# Altium project LCR.PrjPcb
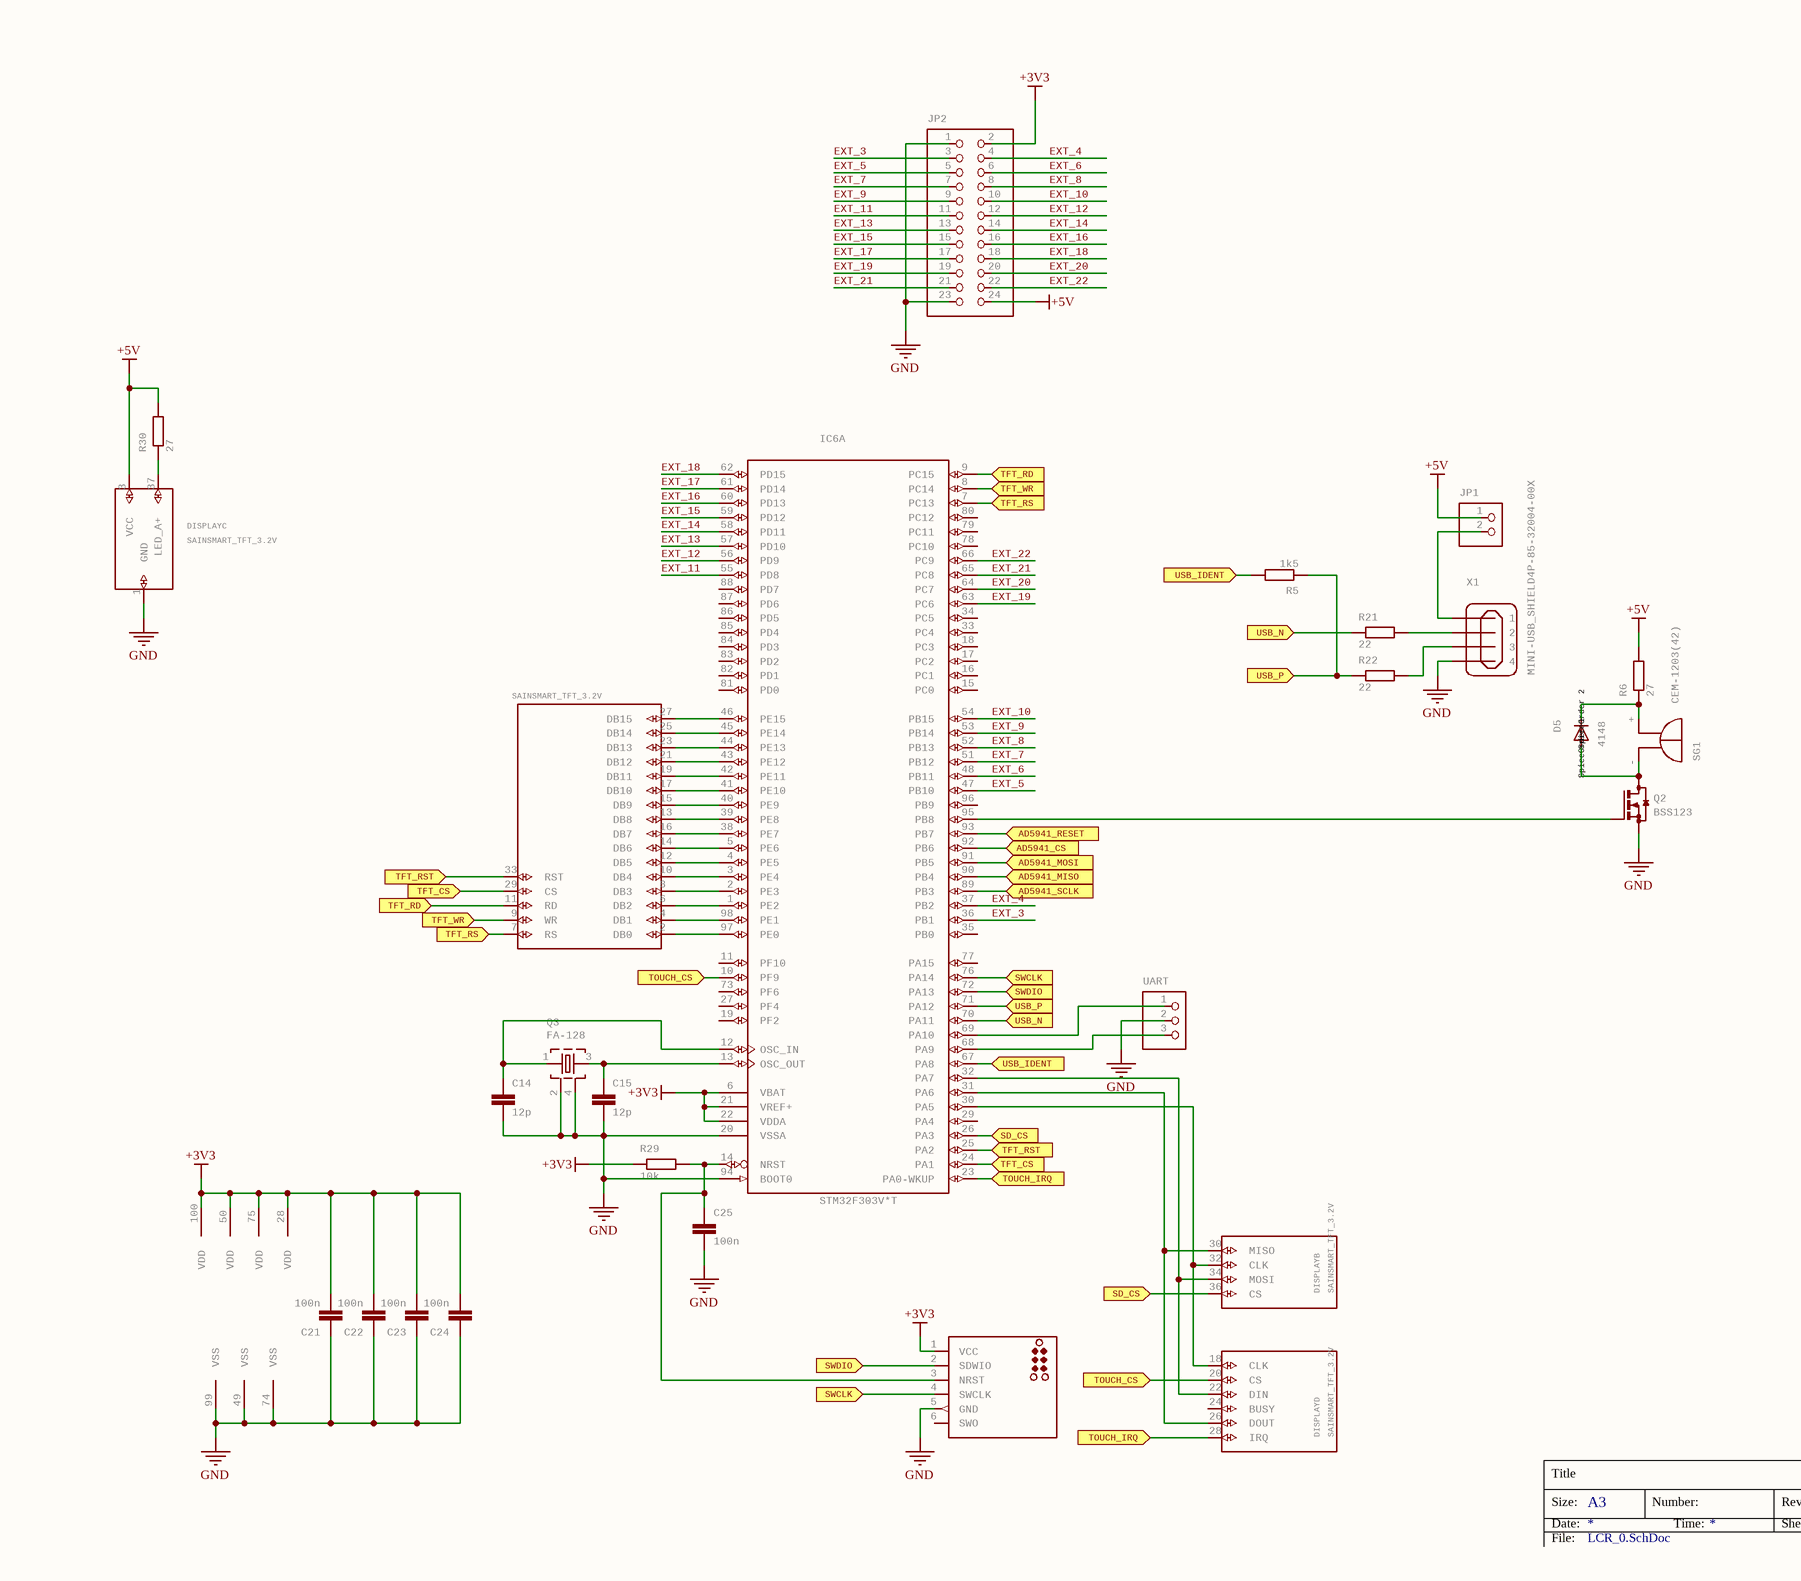
[diagram p0: LCR_0.SchDoc]
3 sheets, 95 parts. Net scope: flat (ports and power ports of the same name join across sheets).
Board file: LCR.PcbDoc
Sheets:
  LCR_0.SchDoc
  LCR_1.SchDoc
  LCR_2.SchDoc

## Sheet LCR_0.SchDoc
size 316 x 277 mm; Organization: Altium Limited; Address1: L3, 12a Rodborough Rd; Address2: Frenchs Forest; Address3: NSW; Address4: Australia 2086; Origin: Eagle

### Parts
C14  value 12p  [C0603K]
C15  value 12p  [C0603K]
C21  value 100n  [C0603K]
C22  value 100n  [C0603K]
C23  value 100n  [C0603K]
C24  value 100n  [C0603K]
C25  value 100n  [C0603K]
D5  value 4148  SpiceOrder1: SpiceOrder 1  SpiceOrder2: SpiceOrder 2  [SOD123]
DISPLAY  SAINSMART_TFT_3.2V  [SAINSMART_ANGLED]  (parts A,B,C,D of 4)
IC6  STM32F303V*T  [LQFP100]  (parts A,B of 2)
J1  TC2030-MCP  [TC2030-MCP]  (value not drawn)
JP1  (no value)  [1X02]
JP2  (no value)  [2X12]
Q2  BSS123  [SOT23]
Q3  FA-128  [FA-128]
R5  value 1k5  [R0603]
R6  value 27  [R1206]
R21  value 22  [R0603]
R22  value 22  [R0603]
R29  value 10k  [R0603]
R30  value 27  [R1206]
SG1  CEM-1203(42)  [F/QMBIII]
UART  (no value)  [1X03]
X1  MINI-USB_SHIELD4P-85-32004-00X  [85-32004-00X]

### Ports
AD5941_CS (in), AD5941_MISO (in), AD5941_MOSI (in), AD5941_RESET (in), AD5941_SCLK (in), SD_CS (in), SWCLK (in), SWDIO (in), TFT_CS (in), TFT_RD (in), TFT_RS (in), TFT_RST (in), TFT_WR (in), TOUCH_CS (in), TOUCH_IRQ (in), USB_IDENT (in), USB_N (in), USB_P (in)

### Nets
+3V3: C21.2 C22.2 C23.2 C24.2 IC6.6(VBAT) IC6.21(VREF+) IC6.22(VDDA) IC6.28(VDD) IC6.50(VDD) IC6.75(VDD) IC6.100(VDD) J1.1(VCC) JP2.2 R29.1
+5V: DISPLAY.3(VCC) JP1.1 JP2.24 R6.2 R30.2
GND: C14.2 C15.2 C21.1 C22.1 C23.1 C24.1 C25.2 DISPLAY.1(GND) IC6.20(VSSA) IC6.49(VSS) IC6.74(VSS) IC6.94(BOOT0) IC6.99(VSS) J1.5(GND) JP2.1 JP2.23 Q2.2(S) Q3.2 Q3.4 UART.2 X1.4
EXT_3: IC6.36(PB1) JP2.3
EXT_4: IC6.37(PB2) JP2.4
EXT_5: IC6.47(PB10) JP2.5
EXT_6: IC6.48(PB11) JP2.6
EXT_7: IC6.51(PB12) JP2.7
EXT_8: IC6.52(PB13) JP2.8
EXT_9: IC6.53(PB14) JP2.9
EXT_10: IC6.54(PB15) JP2.10
EXT_11: IC6.55(PD8) JP2.11
EXT_12: IC6.56(PD9) JP2.12
EXT_13: IC6.57(PD10) JP2.13
EXT_14: IC6.58(PD11) JP2.14
EXT_15: IC6.59(PD12) JP2.15
EXT_16: IC6.60(PD13) JP2.16
EXT_17: IC6.61(PD14) JP2.17
EXT_18: IC6.62(PD15) JP2.18
EXT_19: IC6.63(PC6) JP2.19
EXT_20: IC6.64(PC7) JP2.20
EXT_21: IC6.65(PC8) JP2.21
EXT_22: IC6.66(PC9) JP2.22
NetC14_1: C14.1 IC6.12(OSC_IN) Q3.1
NetC15_1: C15.1 IC6.13(OSC_OUT) Q3.3
NetC25_1: C25.1 IC6.14(NRST) J1.3(NRST) R29.2
NetD5_A: D5.A Q2.3(D) SG1.-(+)
NetD5_C: D5.C R6.1 SG1.+(-)
NetDISPLAY_2: DISPLAY.2(DB0) IC6.97(PE0)
NetDISPLAY_4: DISPLAY.4(DB1) IC6.98(PE1)
NetDISPLAY_6: DISPLAY.6(DB2) IC6.1(PE2)
NetDISPLAY_7: DISPLAY.7(RS) IC6.7(PC13) ; port TFT_RS
NetDISPLAY_8: DISPLAY.8(DB3) IC6.2(PE3)
NetDISPLAY_9: DISPLAY.9(WR) IC6.8(PC14) ; port TFT_WR
NetDISPLAY_10: DISPLAY.10(DB4) IC6.3(PE4)
NetDISPLAY_11: DISPLAY.11(RD) IC6.9(PC15) ; port TFT_RD
NetDISPLAY_12: DISPLAY.12(DB5) IC6.4(PE5)
NetDISPLAY_13: DISPLAY.13(DB8) IC6.39(PE8)
NetDISPLAY_14: DISPLAY.14(DB6) IC6.5(PE6)
NetDISPLAY_15: DISPLAY.15(DB9) IC6.40(PE9)
NetDISPLAY_16: DISPLAY.16(DB7) IC6.38(PE7)
NetDISPLAY_17: DISPLAY.17(DB10) IC6.41(PE10)
NetDISPLAY_18: DISPLAY.18(CLK) DISPLAY.32(CLK) IC6.30(PA5)
NetDISPLAY_19: DISPLAY.19(DB11) IC6.42(PE11)
NetDISPLAY_20: DISPLAY.20(CS) IC6.10(PF9) ; port TOUCH_CS
NetDISPLAY_21: DISPLAY.21(DB12) IC6.43(PE12)
NetDISPLAY_22: DISPLAY.22(DIN) DISPLAY.34(MOSI) IC6.32(PA7)
NetDISPLAY_23: DISPLAY.23(DB13) IC6.44(PE13)
NetDISPLAY_25: DISPLAY.25(DB14) IC6.45(PE14)
NetDISPLAY_26: DISPLAY.26(DOUT) DISPLAY.30(MISO) IC6.31(PA6)
NetDISPLAY_27: DISPLAY.27(DB15) IC6.46(PE15)
NetDISPLAY_28: DISPLAY.28(IRQ) IC6.23(PA0-WKUP) ; port TOUCH_IRQ
NetDISPLAY_29: DISPLAY.29(CS) IC6.24(PA1) ; port TFT_CS
NetDISPLAY_33: DISPLAY.33(RST) IC6.25(PA2) ; port TFT_RST
NetDISPLAY_36: DISPLAY.36(CS) IC6.26(PA3) ; port SD_CS
NetDISPLAY_37: DISPLAY.37(LED_A+) R30.1
NetIC3_2: IC6.93(PB7) ; port AD5941_RESET
NetIC3_3: IC6.92(PB6) ; port AD5941_CS
NetIC3_4: IC6.89(PB3) ; port AD5941_SCLK
NetIC3_5: IC6.91(PB5) ; port AD5941_MOSI
NetIC3_6: IC6.90(PB4) ; port AD5941_MISO
NetIC6_67: IC6.67(PA8) R5.2 ; port USB_IDENT
NetIC6_68: IC6.68(PA9) UART.3
NetIC6_69: IC6.69(PA10) UART.1
NetIC6_70: IC6.70(PA11) R21.1 ; port USB_N
NetIC6_71: IC6.71(PA12) R5.1 R22.1 ; port USB_P
NetIC6_72: IC6.72(PA13) J1.2(SDWIO) ; port SWDIO
NetIC6_76: IC6.76(PA14) J1.4(SWCLK) ; port SWCLK
NetIC6_95: IC6.95(PB8) Q2.1(G)
NetJP1_2: JP1.2 X1.1
NetR21_2: R21.2 X1.2
NetR22_2: R22.2 X1.3

Not connected (* = marked no-connect by the designer): DISPLAY 24(BUSY); IC6 11(PF10) 15(PC0) 16(PC1) 17(PC2) 18(PC3) 19(PF2) 27(PF4) 29(PA4) 33(PC4) 34(PC5) 35(PB0) 73(PF6) 77(PA15) 78(PC10) 79(PC11) 80(PC12) 81(PD0) 82(PD1) 83(PD2) 84(PD3) 85(PD4) 86(PD5) 87(PD6) 88(PD7) 96(PB9); J1 6(SWO)

### Notes on the sheet
- Title
- Size:
- Date:
- A3
- Number:
- Time:
- Revision:
- Sheet
- of
- RayaBonyanLotus
- File:

### Library data of the parts
C14 C15 C21-C25 = C-EUC0603K: CAPACITOR, European symbol; GateName_1: G$1; SymbolName_1: C-EU; DeviceName: C0603K; LibraryName: rcl; DeviceSetName: C-EU
D5 = DIODE-SOD123: DIODE; GateName_1: G$1; SymbolName_1: D; DeviceSetName: DIODE-; DeviceName: SOD123; LibraryName: diode
DISPLAY = SAINSMART_TFT_3.2V: GateName_1: SSD1289; SymbolName_1: LCDCONTROLLER; GateName_2: SD-CARD; SymbolName_2: LCDSD; GateName_3: SUPPLY; SymbolName_3: LCDSUPPLY; GateName_4: ADS7843; SymbolName_4: LCDTOUCH; DeviceName: V; LibraryName: sainsmart; DeviceSetName: SAINSMART_TFT_3.2
IC6 = STM32F303V*T: ARM 32-bit Cortexâ„¢-M3 CPU   72 MHz maximum frequency 128 to 256 Kbytes of Flash memory 32 to 40 kbytes of SRAM 87 GPIOs 2.0 to 3.6 V application supply; GateName_1: MCU; SymbolName_1: STM32_100PIN_TYP3; GateName_2: PWR; SymbolName_2: PWR_VDD4_VSS3; LibraryName: micro-stm_v3; DeviceSetName: STM32F303V*T
J1 = TC2030-MCP: TAG-CONNECT ICSP Connector  Manufacturer: Tag-Connect  Cable for easy In-Circuit Serial Programming. Designed for Microchip ICD2, suitable for many others. Two variants - one "with legs" (for hands-free fit on PCB) and another "without legs" for quick programming.       	   PAD	Description	   1	MCLR/Vpp	   2	Vdd	   3	GND	   4	PGD (ISPDAT)	   5	PGC (ISPCLK)	   6	nc (used for LVP)		  آ©2009 ROFA.cz - modified and updated by Robert Darlington ‹rdarlington@gmail.com›; GateName_1: G$1; DeviceName: -MCP; DeviceSetName: TC2030; SymbolName_1: ICSP; LibraryName: tag-connect
JP1 = PINHD-1X2: PIN HEADER; GateName_1: G$1; SymbolName_1: PINHD2; LibraryName: pinhead; DeviceSetName: PINHD-1X2; VALUE: PINHD-1X2
JP2 = PINHD-2X12: PIN HEADER; GateName_1: A; SymbolName_1: PINH2X12; LibraryName: pinhead; DeviceSetName: PINHD-2X12; VALUE: PINHD-2X12
Q2 = BSS123: N-CHANNEL MOS FET; GateName_1: G$1; SymbolName_1: N-MOS; LibraryName: transistor-small-signal; DeviceSetName: BSS123
Q3 = FA-128: MHz RANGE CRYSTAL UNIT    Source: Epson Toyocom; GateName_1: G$1; SymbolName_1: Q-SHIELD2; DeviceName: 128; DeviceSetName: FA-; LibraryName: crystal
R5 R21 R22 R29 = R-EU_R0603: RESISTOR, European symbol; GateName_1: G$1; SymbolName_1: R-EU-1; DeviceSetName: R-EU_; DeviceName: R0603; LibraryName: resistor
R6 R30 = R-EU_R1206: RESISTOR, European symbol; GateName_1: G$1; SymbolName_1: R-EU-1; DeviceSetName: R-EU_; DeviceName: R1206; LibraryName: resistor
SG1 = F/QMBIII: BUZZER    Source: Buerklin; GateName_1: G$1; SymbolName_1: B; LibraryName: buzzer; DeviceSetName: F/QMBIII; MF: MF; MPN: MPN; OC_FARNELL: unknown; OC_NEWARK: unknown
UART = PINHD-1X3: PIN HEADER; GateName_1: A; SymbolName_1: PINHD3; LibraryName: pinhead; DeviceSetName: PINHD-1X3; VALUE: PINHD-1X3
X1 = MINI-USB_SHIELD4P-85-32004-00X: MINI USB 4 Pol.   Source: www.cypressindustries.com; GateName_1: G$1; SymbolName_1: MINI-USB-4P-; DeviceName: 85-32004-00X; LibraryName: con-cypressindustries; DeviceSetName: MINI-USB_SHIELD4P-; MF: MF; MPN: MPN; OC_FARNELL: unknown; OC_NEWARK: unknown

## Sheet LCR_1.SchDoc
size 282 x 203 mm; DRAWING_NAME: LCR; LAST_DATE_TIME: 22/09/30 10:23:00 PM; SHEET: 2; LAST_DATE_TIME: 22/09/30 10:23:00 PM; Organization: Altium Limited; Address1: L3, 12a Rodborough Rd; Address2: Frenchs Forest; Address3: NSW; Address4: Australia 2086; DRAWING_NAME: LCR; SHEET: 2; Origin: Eagle
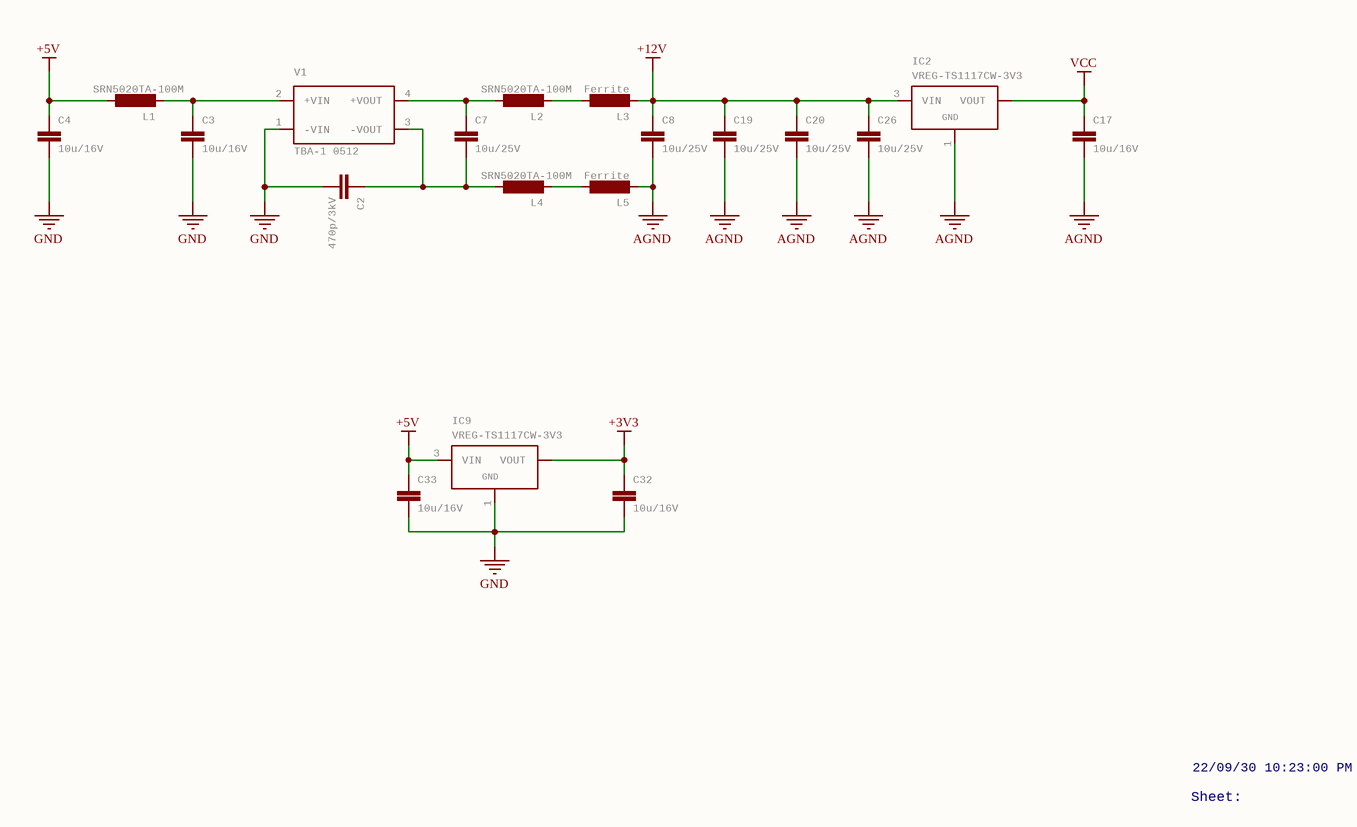
[diagram p1: LCR_1.SchDoc]

### Parts
C2  value 470p/3kV  [C1812]
C3  value 10u/16V  [C1206K]
C4  value 10u/16V  [C1206K]
C7  value 10u/25V  [C1206K]
C8  value 10u/25V  [C1206K]
C17  value 10u/16V  [C1206K]
C19  value 10u/25V  [C1206K]
C20  value 10u/25V  [C1206K]
C26  value 10u/25V  [C1206K]
C32  value 10u/16V  [C1206K]
C33  value 10u/16V  [C1206K]
IC2  VREG-TS1117CW-3V3  [SOT223]
IC9  VREG-TS1117CW-3V3  [SOT223]
L1  SRN5020TA-100M  [SRN5040]
L2  SRN5020TA-100M  [SRN5040]
L3  Ferrite  [R0603]
L4  SRN5020TA-100M  [SRN5040]
L5  Ferrite  [R0603]
V1  TBA-1 0512  [TME]

### Nets
+3V3: C32.1 IC9.2_4(VOUT)
+5V: C4.1 C33.1 IC9.3(VIN) L1.P$1
+12V: C8.1 C19.1 C20.1 C26.1 IC2.3(VIN) L3.2
AGND: C8.2 C17.2 C19.2 C20.2 C26.2 IC2.1(GND) L5.2
GND: C2.2 C3.2 C4.2 C32.2 C33.2 IC9.1(GND) V1.1(-VIN)
VCC: C17.1 IC2.2_4(VOUT)
NetC2_1: C2.1 C7.2 L4.P$1 V1.3(-VOUT)
NetC3_1: C3.1 L1.P$2 V1.2(+VIN)
NetC7_1: C7.1 L2.P$1 V1.4(+VOUT)
NetL2_P$2: L2.P$2 L3.1
NetL4_P$2: L4.P$2 L5.1

### Notes on the sheet
- Sheet:
- 22/09/30 10:23:00 PM
- Title
- Size:
- Date:
- A3
- Number:
- Time:
- Revision:
- Sheet
- of
- RayaBonyanLotus
- File:

### Library data of the parts
C2 = C-EUC1812: CAPACITOR, European symbol; GateName_1: G$1; SymbolName_1: C-EU-1; DeviceSetName: C-EU; DeviceName: C1812; LibraryName: resistor
C3 C4 C7 C8 C17 C19 C20 C26 C32 C33 = C-EUC1206K: CAPACITOR, European symbol; GateName_1: G$1; SymbolName_1: C-EU; DeviceName: C1206K; LibraryName: rcl; DeviceSetName: C-EU
IC2 IC9 = VREG-TS1117CW-3V3: Voltage Regulators (LDOs, Switching Converters...)  LDOs Taiwan Semi TS1117 800mA max 15V  - compatible On Semi NCP1117 1A max 20V  - compatible Diodes AP2111H 0.6A max 6V (0.25V@0.6A)  - compatible Diodes AP2114H 1A max 6V (0.45V@1A) Taiwan Semi TS9011 250mA max 12V  - compatible Diodes AP2210 300mA max 15V  - compatible Microchip MCP1700 250mA max 6.5V  - compatible Microchip MCP1702 250mA max 13V  - compatible Microchip MCP1703 250mA max 16V  - compatible Microchip MCP1754 150mA max 16V Taiwan Semi TS5204 150mA max 16V (low noise)  DC/DC Converter Modules Recom R-78Ex.x-1.0-W36 1A max 28V  - compatible CUI V78xx-2000  2A max 18V Murata OKI-78SR-x.x/1.5-W36 1.5A max 36V; GateName_1: IC; SymbolName_1: VREG; DeviceName: -TS1117CW-3V3; LibraryName: we-power-mod; DeviceSetName: VREG; GND: GND
L1 L2 L4 = SRN5040: GateName_1: G$1; SymbolName_1: L-EU; LibraryName: custom-ic; DeviceSetName: SRN5040
L3 L5 = INDUCTOR0603: GateName_1: G$1; SymbolName_1: L-EU; DeviceName: 0603; LibraryName: rf; DeviceSetName: INDUCTOR
V1 = TME?*05: DC/DC Converter TME Series 1 Watt    Source: www.tracopower.com .. tme.pdf; MPN: TME 0505S; GateName_1: G$1; SymbolName_1: DC-DC-CONVERTER; DeviceName: 05; DeviceSetName: TME?*; LibraryName: traco-electronic; MF: MF; OC_FARNELL: 1007538; OC_NEWARK: 51R5321

## Sheet LCR_2.SchDoc
size 282 x 208 mm; DRAWING_NAME: LCR; LAST_DATE_TIME: 22/09/30 10:23:00 PM; SHEET: 3; LAST_DATE_TIME: 22/09/30 10:23:00 PM; Organization: Altium Limited; Address1: L3, 12a Rodborough Rd; Address2: Frenchs Forest; Address3: NSW; Address4: Australia 2086; DRAWING_NAME: LCR; SHEET: 3; Origin: Eagle
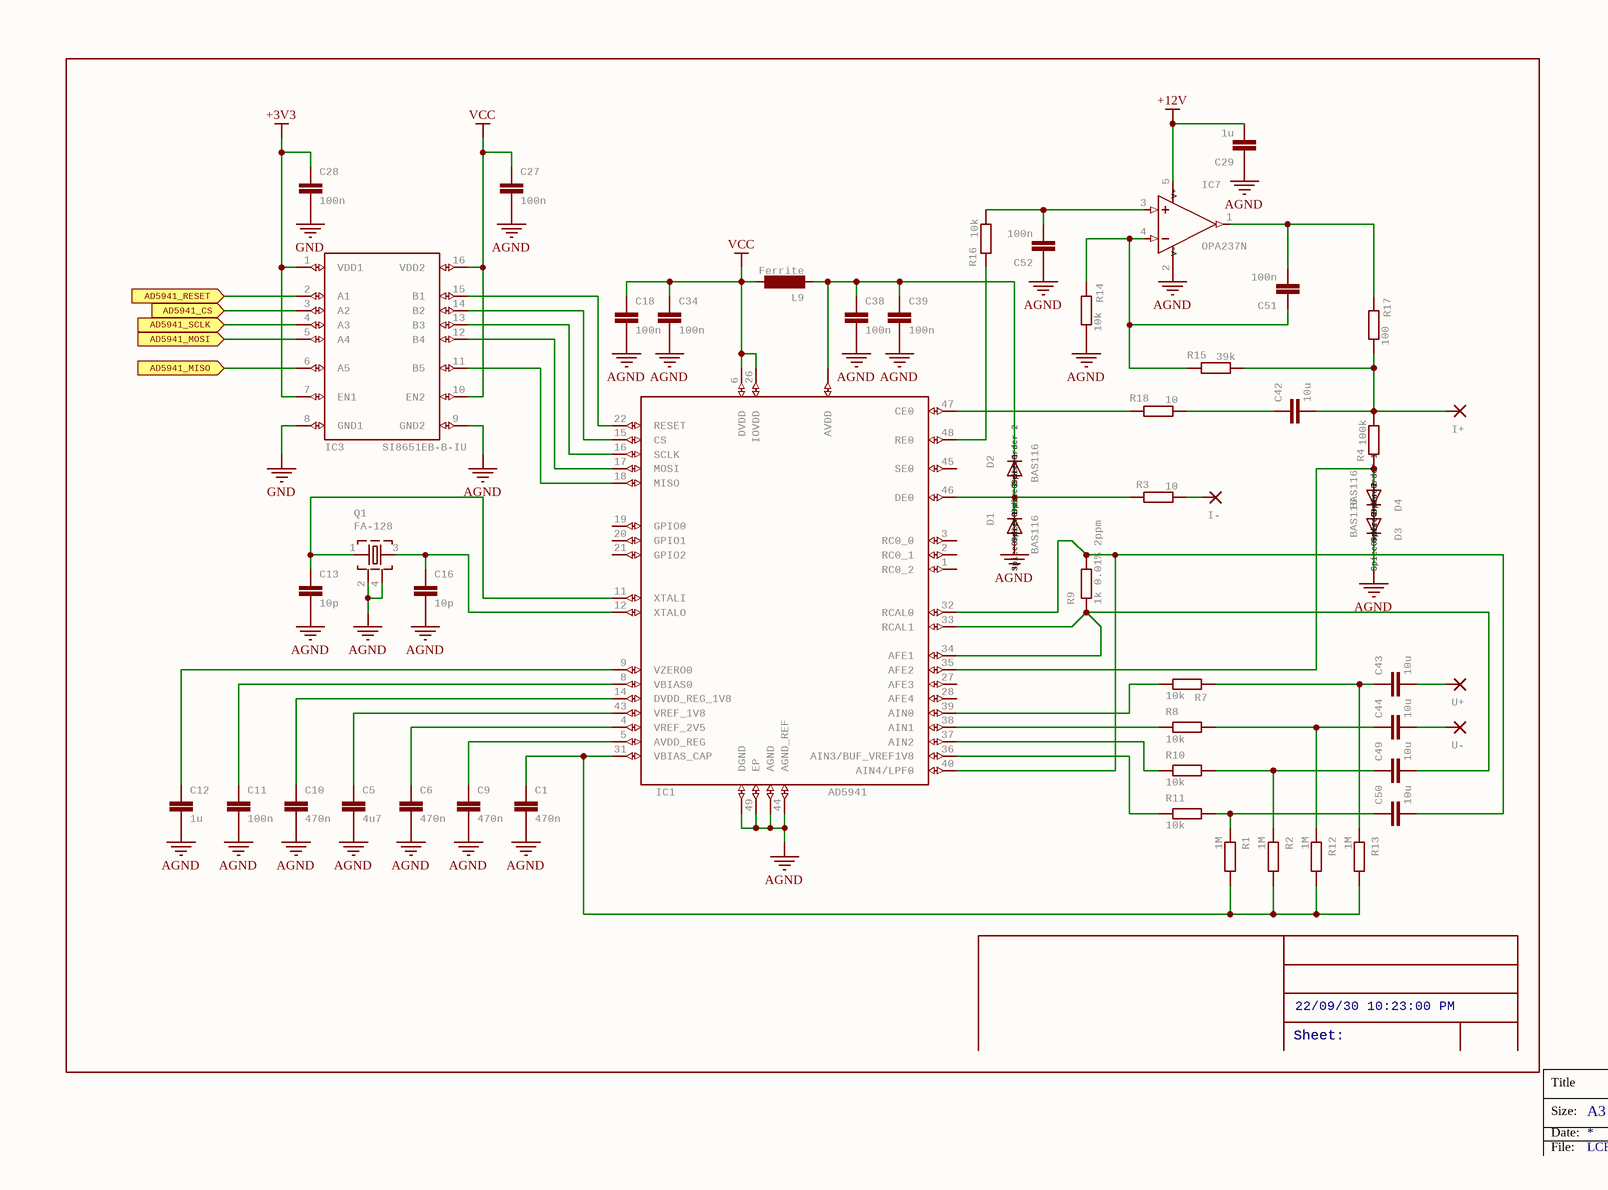
[diagram p2: LCR_2.SchDoc]

### Parts
C1  value 470n  [C0603K]
C5  value 4u7  [C0603K]
C6  value 470n  [C0603K]
C9  value 470n  [C0603K]
C10  value 470n  [C0603K]
C11  value 100n  [C0603K]
C12  value 1u  [C0603K]
C13  value 10p  [C0603K]
C16  value 10p  [C0603K]
C18  value 100n  [C0603K]
C27  value 100n  [C0603K]
C28  value 100n  [C0603K]
C29  value 1u  [C0603K]
C34  value 100n  [C0603K]
C38  value 100n  [C0603K]
C39  value 100n  [C0603K]
C42  value 10u  [C1206K]
C43  value 10u  [C1206K]
C44  value 10u  [C1206K]
C49  value 10u  [C1206K]
C50  value 10u  [C1206K]
C51  value 100n  [C0603K]
C52  value 100n  [C0603K]
D1  value BAS116  SpiceOrder1: SpiceOrder 1  SpiceOrder2: SpiceOrder 2  [SOD123]
D2  value BAS116  SpiceOrder1: SpiceOrder 1  SpiceOrder2: SpiceOrder 2  [SOD123]
D3  value BAS116  SpiceOrder1: SpiceOrder 1  SpiceOrder2: SpiceOrder 2  [SOD123]
D4  value BAS116  SpiceOrder1: SpiceOrder 1  SpiceOrder2: SpiceOrder 2  [SOD123]
I+  (no value)  [2,54/1,1]
I-  (no value)  [2,54/1,1]
IC1  AD5941  [QFN50P700X700X80-49T510N]
IC3  SI8651EB-B-IU  [SOP63P600X175-16N]
IC7  OPA237N  [SOT23-5]
L9  Ferrite  [R0603]
Q1  FA-128  [FA-128]
R1  value 1M  [R0603]
R2  value 1M  [R0603]
R3  value 10  [R0603]
R4  value 100k  [R0603]
R7  value 10k  [R0603]
R8  value 10k  [R0603]
R9  value 1k 0.01% 2ppm  [M0805]
R10  value 10k  [R0603]
R11  value 10k  [R0603]
R12  value 1M  [R0603]
R13  value 1M  [R0603]
R14  value 10k  [R0603]
R15  value 39k  [R0603]
R16  value 10k  [R0603]
R17  value 100  [R0603]
R18  value 10  [R0603]
U+  (no value)  [2,54/1,1]
U-  (no value)  [2,54/1,1]

### Ports
AD5941_CS (in), AD5941_MISO (in), AD5941_MOSI (in), AD5941_RESET (in), AD5941_SCLK (in)

### Nets
+3V3: C28.1 IC3.1(VDD1) IC3.7(EN1)
+12V: C29.2 IC7.5(V+)
AGND: C1.2 C5.2 C6.2 C9.2 C10.2 C11.2 C12.2 C13.2 C16.2 C18.2 C27.2 C29.1 C34.2 C38.2 C39.2 C52.1 D1.A D3.C IC1.13_23_25(DGND) IC1.29_42(AGND) IC1.44(AGND_REF) IC1.49(EP) IC3.9(GND2) IC7.2(V-) Q1.2 Q1.4 R14.1
GND: C28.2 IC3.8(GND1)
VCC: C18.1 C27.1 C34.1 IC1.6(DVDD) IC1.26(IOVDD) IC3.10(EN2) IC3.16(VDD2) L9.1
NetC1_1: C1.1 IC1.31(VBIAS_CAP) R1.2 R2.2 R12.2 R13.2
NetC5_1: C5.1 IC1.43(VREF_1V8)
NetC6_1: C6.1 IC1.4(VREF_2V5)
NetC9_1: C9.1 IC1.5(AVDD_REG)
NetC10_1: C10.1 IC1.14(DVDD_REG_1V8)
NetC11_1: C11.1 IC1.8(VBIAS0)
NetC12_1: C12.1 IC1.9(VZERO0)
NetC13_1: C13.1 IC1.11(XTALI) Q1.1
NetC16_1: C16.1 IC1.12(XTALO) Q1.3
NetC38_1: C38.1 C39.1 D2.C IC1.30_41(AVDD) L9.2
NetC42_1: C42.1 R18.1
NetC42_2: C42.2 I+.1(P) R4.1 R15.1 R17.1
NetC43_1: C43.1 R7.2 R13.1
NetC43_2: C43.2 U+.1(P)
NetC44_1: C44.1 R8.2 R12.1
NetC44_2: C44.2 U-.1(P)
NetC49_1: C49.1 R2.1 R10.2
NetC49_2: C49.2 IC1.33(RCAL1) IC1.34(AFE1) R9.1
NetC50_1: C50.1 R1.1 R11.2
NetC50_2: C50.2 D4.A IC1.32(RCAL0) IC1.35(AFE2) IC1.40(AIN4/LPF0) R4.2 R9.2
NetC51_1: C51.1 IC7.4(-IN) R14.2 R15.2
NetC51_2: C51.2 IC7.1(OUT) R17.2
NetC52_2: C52.2 IC7.3(+IN) R16.1
NetD1_C: D1.C D2.A IC1.46(DE0) R3.2
NetD3_A: D3.A D4.C
NetI-_1: I-.1(P) R3.1
NetIC1_15: IC1.15(CS) IC3.14(B2)
NetIC1_16: IC1.16(SCLK) IC3.13(B3)
NetIC1_17: IC1.17(MOSI) IC3.12(B4)
NetIC1_18: IC1.18(MISO) IC3.11(B5)
NetIC1_22: IC1.22(RESET) IC3.15(B1)
NetIC1_36: IC1.36(AIN3/BUF_VREF1V8) R11.1
NetIC1_37: IC1.37(AIN2) R10.1
NetIC1_38: IC1.38(AIN1) R8.1
NetIC1_39: IC1.39(AIN0) R7.1
NetIC1_47: IC1.47(CE0) R18.2
NetIC1_48: IC1.48(RE0) R16.2
NetIC3_2: IC3.2(A1) ; port AD5941_RESET
NetIC3_3: IC3.3(A2) ; port AD5941_CS
NetIC3_4: IC3.4(A3) ; port AD5941_SCLK
NetIC3_5: IC3.5(A4) ; port AD5941_MOSI
NetIC3_6: IC3.6(A5) ; port AD5941_MISO

Not connected (* = marked no-connect by the designer): IC1 1(RC0_2) 2(RC0_1) 3(RC0_0) 19(GPIO0) 20(GPIO1) 21(GPIO2) 27(AFE3) 28(AFE4) 45(SE0)

### Notes on the sheet
- Sheet:
- 22/09/30 10:23:00 PM
- Title
- Size:
- Date:
- A3
- Number:
- Time:
- Revision:
- Sheet
- of
- RayaBonyanLotus
- File:

### Library data of the parts
C1 C5 C6 C9-C13 C16 C18 C27-C29 C34 C38 C39 C51 C52 = C-EUC0603K: as C14 on sheet LCR_0; DeviceName: C0603K; LibraryName: rcl; DeviceSetName: C-EU
C42-C44 C49 C50 = C-EUC1206K: CAPACITOR, European symbol; GateName_1: G$1; SymbolName_1: C-EU-1; DeviceSetName: C-EU; DeviceName: C1206K; LibraryName: resistor
D1-D4 = DIODE-SOD123: as D5 on sheet LCR_0; DeviceName: SOD123; LibraryName: diode
I+ I- U+ U- = 2,54/1,1: THROUGH-HOLE PAD; GateName_1: 1; SymbolName_1: PAD; LibraryName: wirepad; DeviceSetName: 2,54/1,1; VALUE: 2,54/1,1
IC1 = AD5941: GateName_1: G$1; SymbolName_1: AD5941; LibraryName: custom-ic; DeviceSetName: AD5941
IC3 = SI8651EB-B-IU: GateName_1: G$1; SymbolName_1: SI8651; DeviceName: EB-B-IU; LibraryName: custom-ic; DeviceSetName: SI8651
IC7 = OPA237N: Operational Amplifiers   Single-Supply, MicroAmplifier(TM) Series; MPN: OPA237NA/250; GateName_1: G$1; SymbolName_1: OP-AMP+-; DeviceName: N; DeviceSetName: OPA237; MF: TEXAS INSTRUMENTS; LibraryName: burr-brown; V+: V+; V-: V-; OC_FARNELL: 4625298; OC_NEWARK: 35C1874
L9 = INDUCTOR0603: as L3 on sheet LCR_1; LibraryName: rf; DeviceSetName: INDUCTOR
Q1 = FA-128: as Q3 on sheet LCR_0; LibraryName: crystal
R1-R4 R7 R8 R10-R18 = R-EU_R0603: RESISTOR, European symbol; GateName_1: G$1; SymbolName_1: R-EU; DeviceSetName: R-EU_; DeviceName: R0603; LibraryName: rcl
R9 = R-EU_M0805: RESISTOR, European symbol; GateName_1: G$1; SymbolName_1: R-EU-1; DeviceSetName: R-EU_; DeviceName: M0805; LibraryName: resistor

## Nets that join several sheets
+3V3: LCR_0 (14 pins), LCR_1 (C32.1 IC9.2 4), LCR_2 (C28.1 IC3.1 IC3.7)
+5V: LCR_0 (5 pins), LCR_1 (C4.1 C33.1 IC9.3 L1.P$1)
+12V: LCR_1 (6 pins), LCR_2 (C29.2 IC7.5)
AGND: LCR_1 (7 pins), LCR_2 (27 pins)
GND: LCR_0 (21 pins), LCR_1 (7 pins), LCR_2 (C28.2 IC3.8)
VCC: LCR_1 (C17.1 IC2.2 4), LCR_2 (8 pins)
NetIC3_2: LCR_0 (IC6.93), LCR_2 (IC3.2)
NetIC3_3: LCR_0 (IC6.92), LCR_2 (IC3.3)
NetIC3_4: LCR_0 (IC6.89), LCR_2 (IC3.4)
NetIC3_5: LCR_0 (IC6.91), LCR_2 (IC3.5)
NetIC3_6: LCR_0 (IC6.90), LCR_2 (IC3.6)